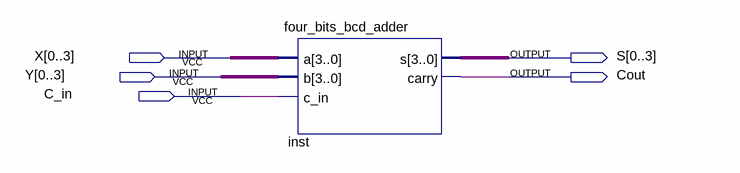
[diagram p0: schematic sheet]
// Quartus schematic fourBitsBCD.bdf as structural Verilog: 1 symbols, 5 pins
module fourBitsBCD (
  input  [0:3] X,
  input  [0:3] Y,
  input  C_in,
  output [0:3] S,
  output Cout
);

  four_bits_bcd_adder inst (.a(X), .b(Y), .c_in(C_in), .s(S), .carry(Cout));
endmodule
